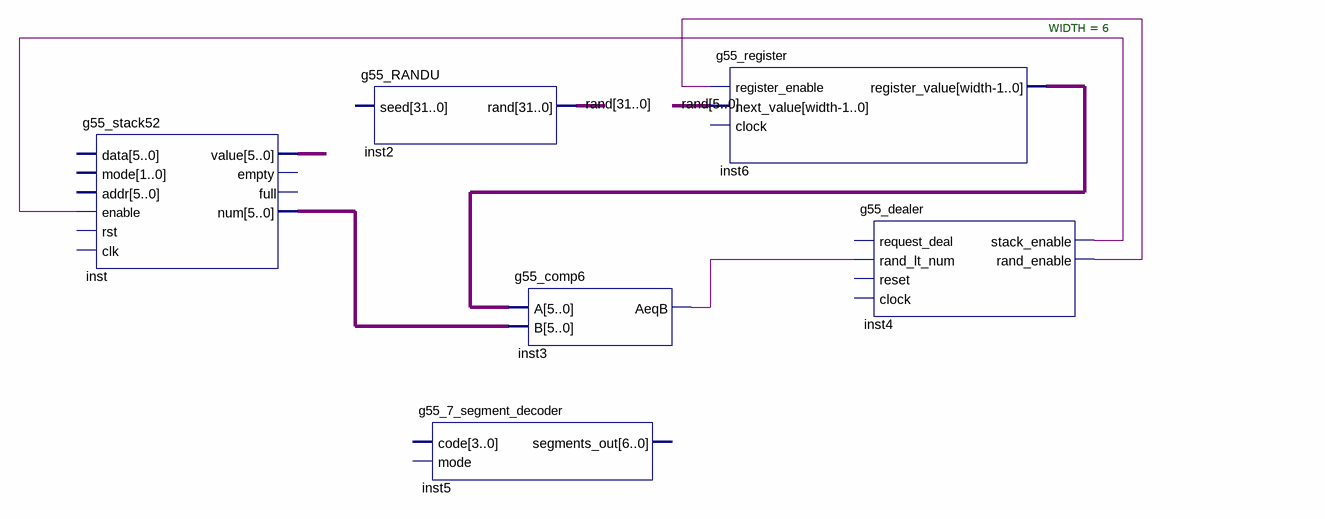
[diagram p0: schematic sheet]
// Quartus schematic g55_dealer_testbench.bdf as structural Verilog: 6 symbols, 0 pins
module g55_dealer_testbench (
);

  wire inst3_aeqb, inst4_rand_enable, inst4_stack_enable;
  wire [5:0] inst6_register_value, inst_num, inst_value;
  wire [31:0] \rand ;

  g55_stack52 inst (
    .enable(inst4_stack_enable), .value(inst_value), .num(inst_num));  // open: data, mode, addr, rst, clk, empty, full
  g55_RANDU inst2 (.\rand (\rand ));  // open: seed
  g55_7_segment_decoder inst5 ();  // open: code, mode, segments_out
  g55_comp6 inst3 (.A(inst6_register_value), .B(inst_num), .AeqB(inst3_aeqb));
  g55_register #(.WIDTH(6)) inst6 (
    .register_enable(inst4_rand_enable), .next_value(\rand [5:0]), .register_value(inst6_register_value));  // open: clock
  g55_dealer inst4 (
    .rand_lt_num(inst3_aeqb), .stack_enable(inst4_stack_enable), .rand_enable(inst4_rand_enable));  // open: request_deal, reset, clock
endmodule
